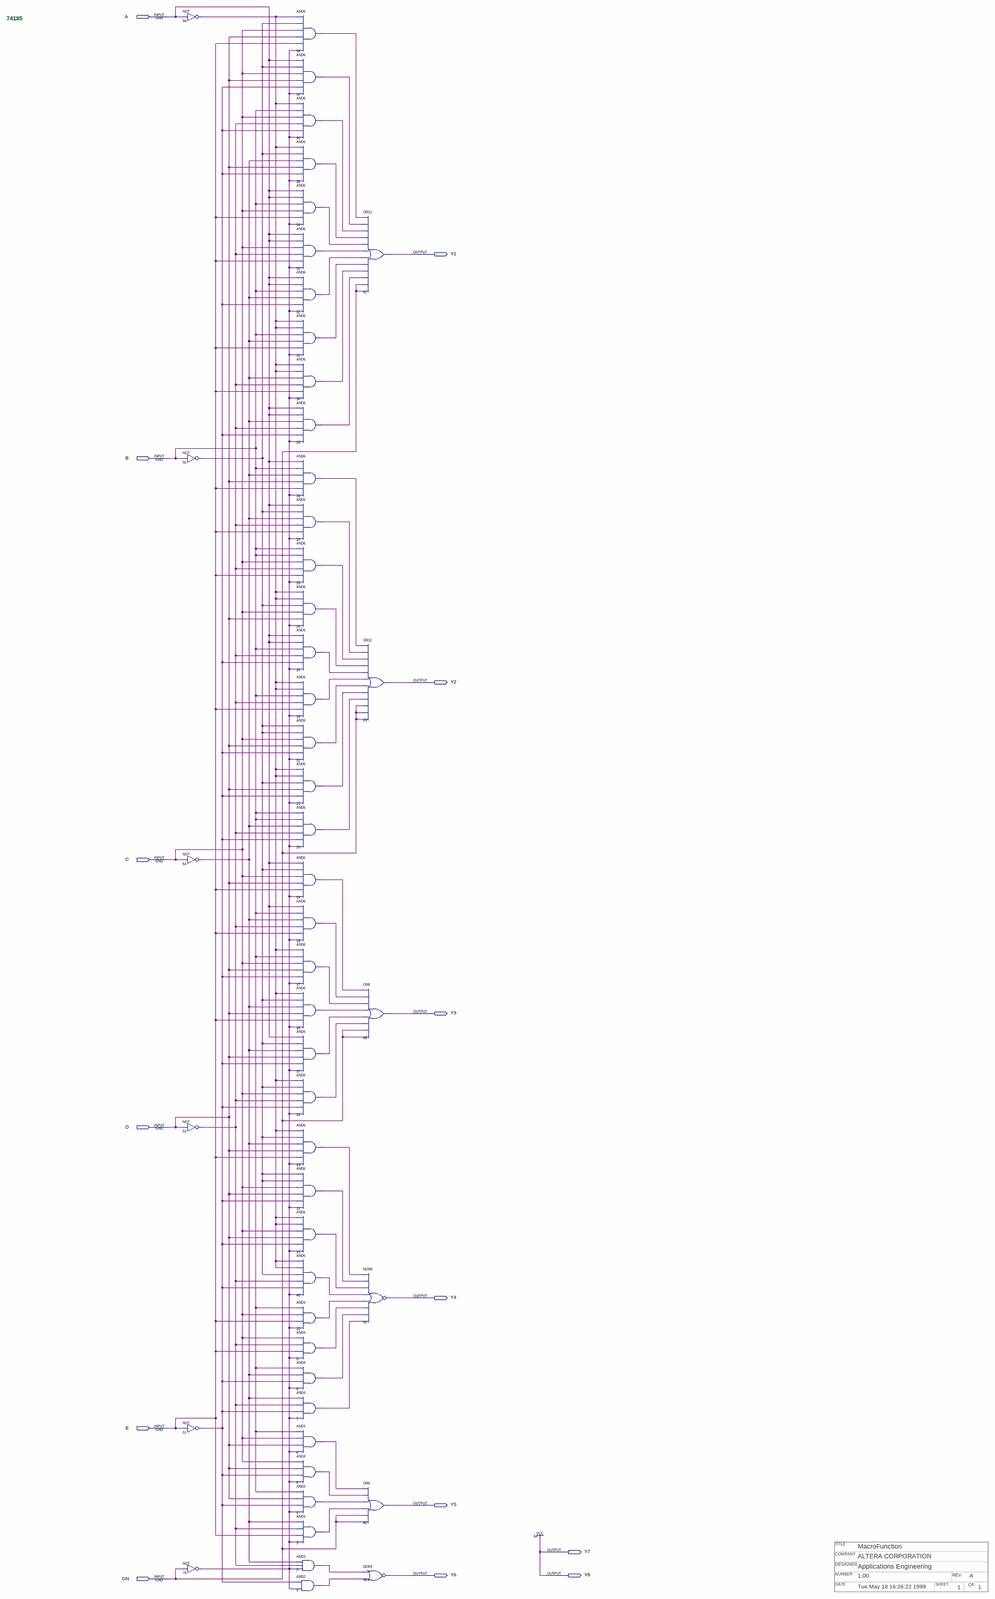
[diagram p0: schematic sheet, whole]
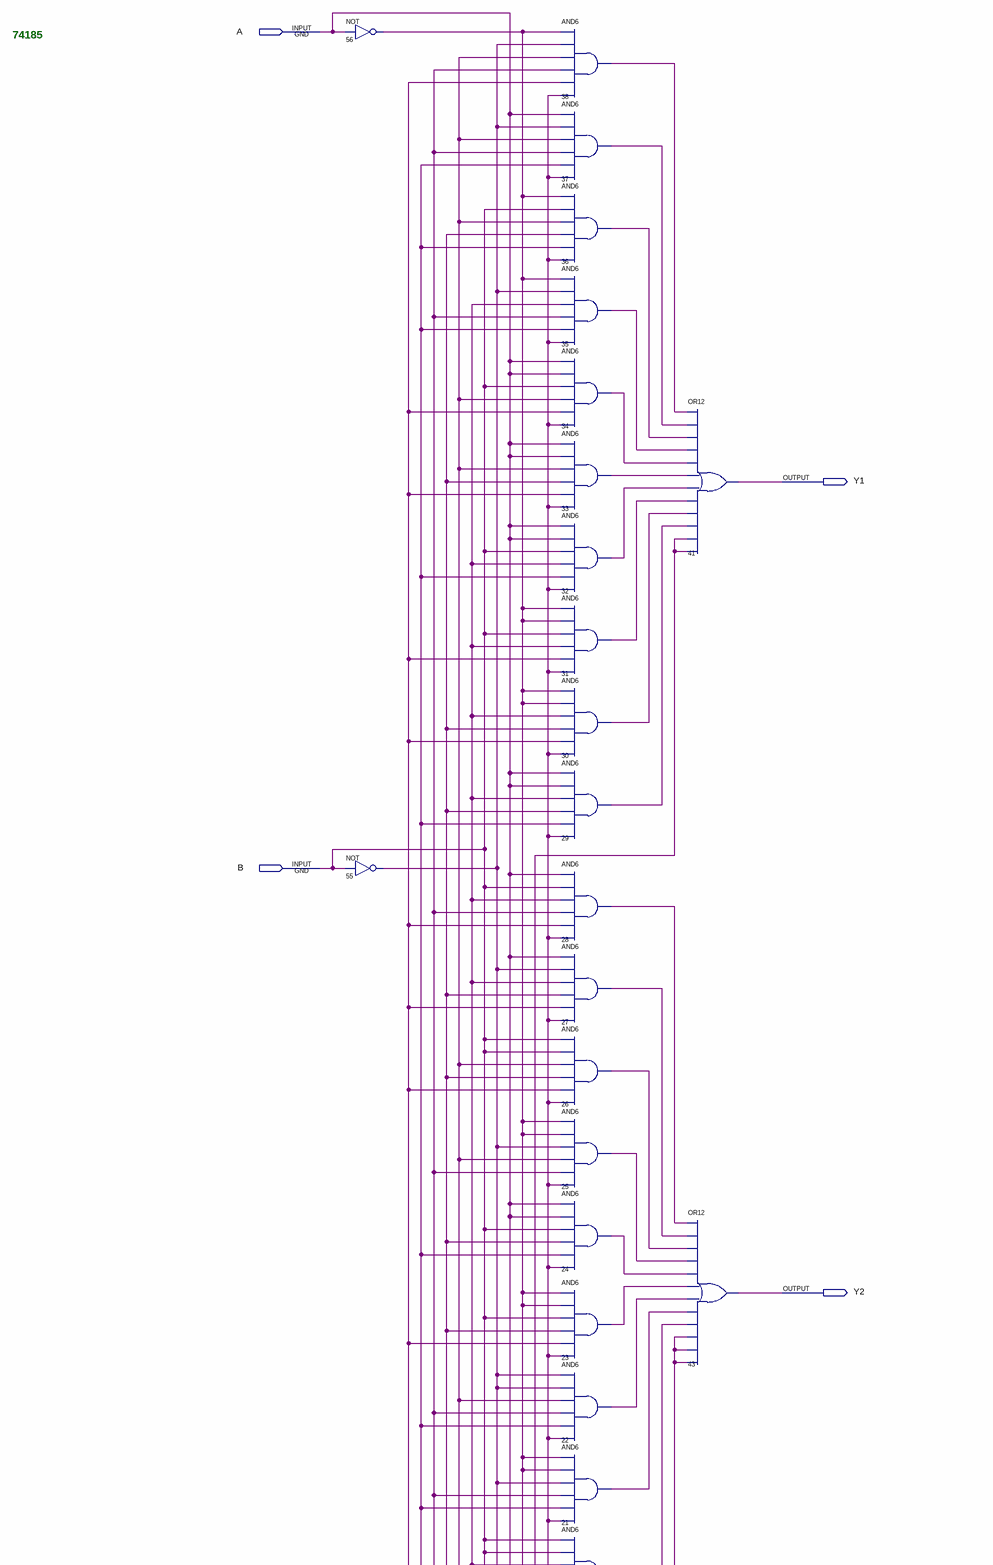
[diagram p1: schematic sheet, upper left part]
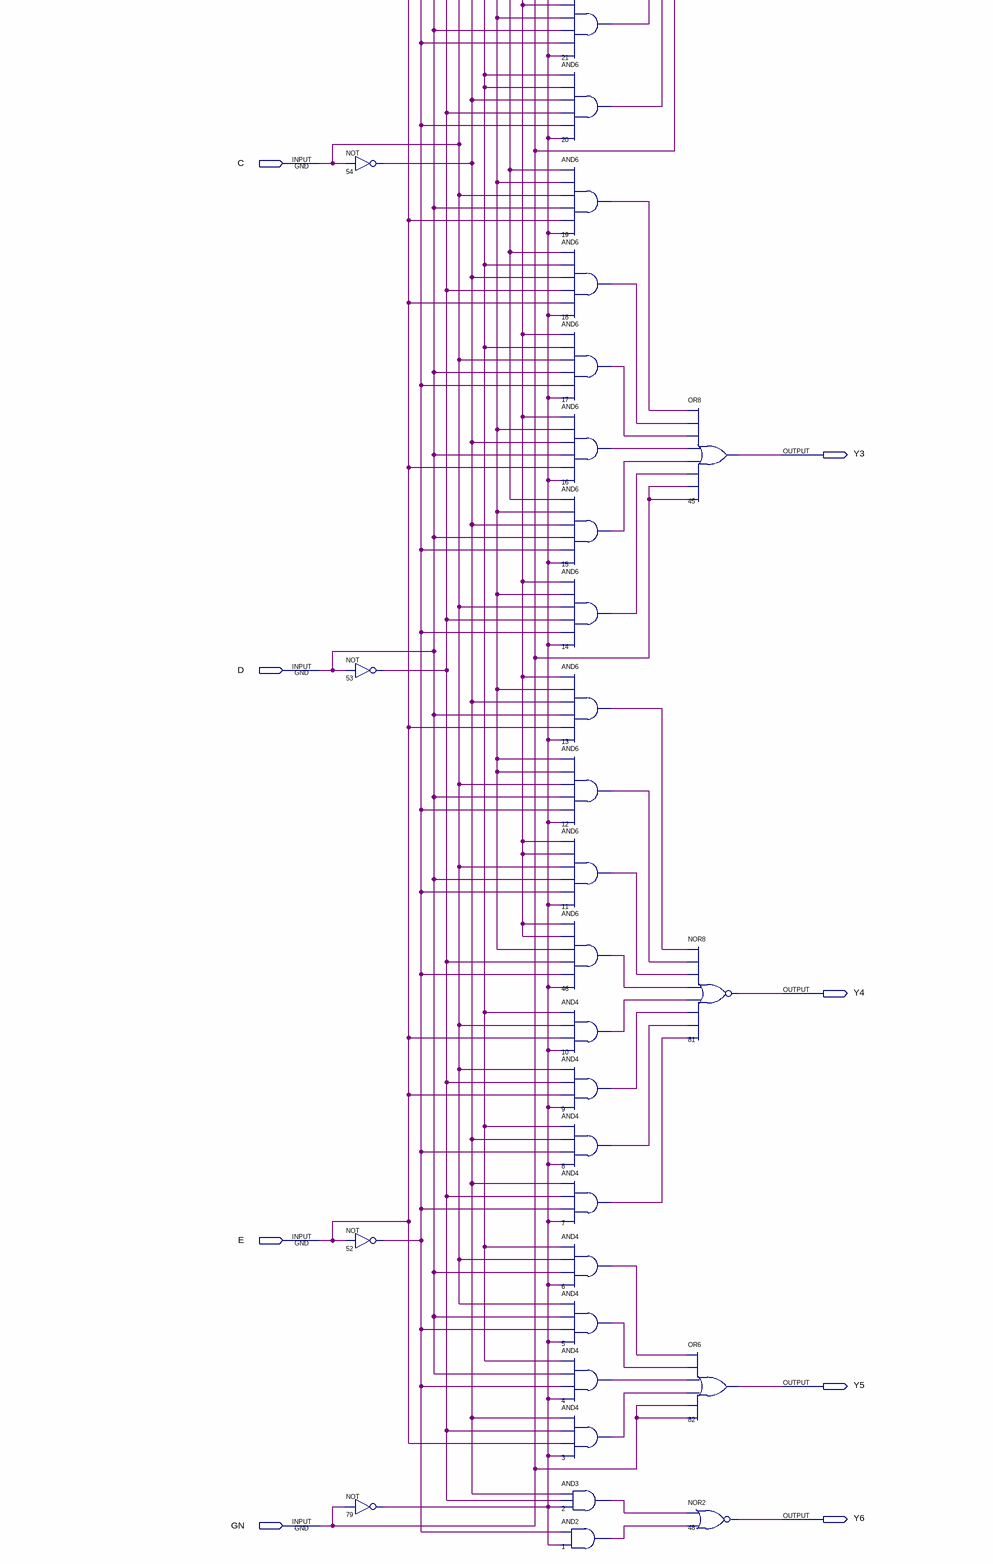
[diagram p2: schematic sheet, lower left part]
// Quartus schematic 74185.bdf as structural Verilog: 51 symbols, 14 pins
// Title block: TITLE: MacroFunction; COMPANY: ALTERA CORPORATION; DESIGNER: Applications Engineering; NUMBER: 1.00; REV: A; DATE: Tue May 18 16:26:22 1999; SHEET: 1; OF: 1
module \74185  (
  input  A,
  input  B,
  input  C,
  input  D,
  input  E,
  input  GN,
  output Y1,
  output Y2,
  output Y3,
  output Y4,
  output Y5,
  output Y7,
  output Y6,
  output Y8
);

  wire n1_out, n2_out, n3_out, n4_out, n5_out, n6_out, n7_out, n8_out, n9_out, n10_out, n11_out, n12_out,
       n13_out, n14_out, n15_out, n16_out, n17_out, n18_out, n19_out, n20_out, n21_out, n22_out, n23_out,
       n24_out, n25_out, n26_out, n27_out, n28_out, n29_out, n30_out, n31_out, n32_out, n33_out, n34_out,
       n35_out, n36_out, n37_out, n38_out, n46_out, n52_out, n53_out, n54_out, n55_out, n56_out, n79_out;

  not u_56 (n56_out, A);
  not u_55 (n55_out, B);
  not u_54 (n54_out, C);
  not u_53 (n53_out, D);
  not u_52 (n52_out, E);
  not u_79 (n79_out, GN);
  and u_38 (n38_out, n56_out, n55_out, C, D, E, n79_out);
  and u_37 (n37_out, A, n55_out, C, D, n52_out, n79_out);
  and u_36 (n36_out, n56_out, B, C, n53_out, n52_out, n79_out);
  and u_35 (n35_out, n56_out, n55_out, n54_out, D, n52_out, n79_out);
  and u_34 (n34_out, A, A, B, C, E, n79_out);
  and u_33 (n33_out, A, A, C, n53_out, E, n79_out);
  and u_32 (n32_out, A, A, B, n54_out, n52_out, n79_out);
  and u_31 (n31_out, n56_out, n56_out, B, n54_out, E, n79_out);
  and u_30 (n30_out, n56_out, n56_out, n54_out, n53_out, E, n79_out);
  and u_29 (n29_out, A, A, n54_out, n53_out, n52_out, n79_out);
  and u_28 (n28_out, A, B, n54_out, D, E, n79_out);
  and u_27 (n27_out, A, n55_out, n54_out, n53_out, E, n79_out);
  and u_26 (n26_out, B, B, C, n53_out, E, n79_out);
  and u_25 (n25_out, n56_out, n56_out, n55_out, C, D, n79_out);
  and u_24 (n24_out, A, A, B, n53_out, n52_out, n79_out);
  and u_23 (n23_out, n56_out, n56_out, B, n53_out, E, n79_out);
  and u_22 (n22_out, n55_out, n55_out, C, D, n52_out, n79_out);
  and u_21 (n21_out, n56_out, n56_out, n55_out, D, n52_out, n79_out);
  and u_20 (n20_out, B, B, n54_out, n53_out, n52_out, n79_out);
  and u_19 (n19_out, A, n55_out, C, D, E, n79_out);
  and u_18 (n18_out, A, B, n54_out, n53_out, E, n79_out);
  and u_17 (n17_out, n56_out, B, C, D, n52_out, n79_out);
  and u_16 (n16_out, n56_out, n55_out, n54_out, D, E, n79_out);
  and u_15 (n15_out, A, n55_out, n54_out, D, n52_out, n79_out);
  and u_14 (n14_out, n56_out, n55_out, C, n53_out, n52_out, n79_out);
  and u_13 (n13_out, n56_out, n55_out, n54_out, D, E, n79_out);
  and u_12 (n12_out, n55_out, n55_out, C, D, n52_out, n79_out);
  and u_11 (n11_out, n56_out, n56_out, C, D, n52_out, n79_out);
  and u_46 (n46_out, n56_out, n56_out, n55_out, n53_out, n52_out, n79_out);
  and u_10 (n10_out, B, C, E, n79_out);
  and u_9 (n9_out, C, n53_out, E, n79_out);
  and u_8 (n8_out, B, n54_out, n52_out, n79_out);
  and u_7 (n7_out, n54_out, n53_out, n52_out, n79_out);
  and u_6 (n6_out, B, C, D, n79_out);
  and u_5 (n5_out, C, D, n52_out, n79_out);
  and u_4 (n4_out, B, D, n52_out, n79_out);
  and u_3 (n3_out, n54_out, n53_out, E, n79_out);
  and u_2 (n2_out, n54_out, n53_out, n79_out);
  and u_1 (n1_out, n52_out, n79_out);
  or u_41 (Y1, n38_out, n37_out, n36_out, n35_out, n34_out, n33_out, n32_out, n31_out, n30_out, n29_out, GN, GN);
  or u_43 (Y2, n28_out, n27_out, n26_out, n25_out, n24_out, n23_out, n22_out, n21_out, n20_out, GN, GN, GN);
  or u_45 (Y3, n19_out, n18_out, n17_out, n16_out, n15_out, n14_out, GN, GN);
  nor u_81 (Y4, n13_out, n12_out, n11_out, n46_out, n10_out, n9_out, n8_out, n7_out);
  or u_82 (Y5, n6_out, n5_out, n4_out, n3_out, GN, GN);
  nor u_48 (Y6, n2_out, n1_out);

  assign Y7 = 1'b1;
  assign Y8 = 1'b1;

  // Notes on the sheet:
  //   74185
endmodule
